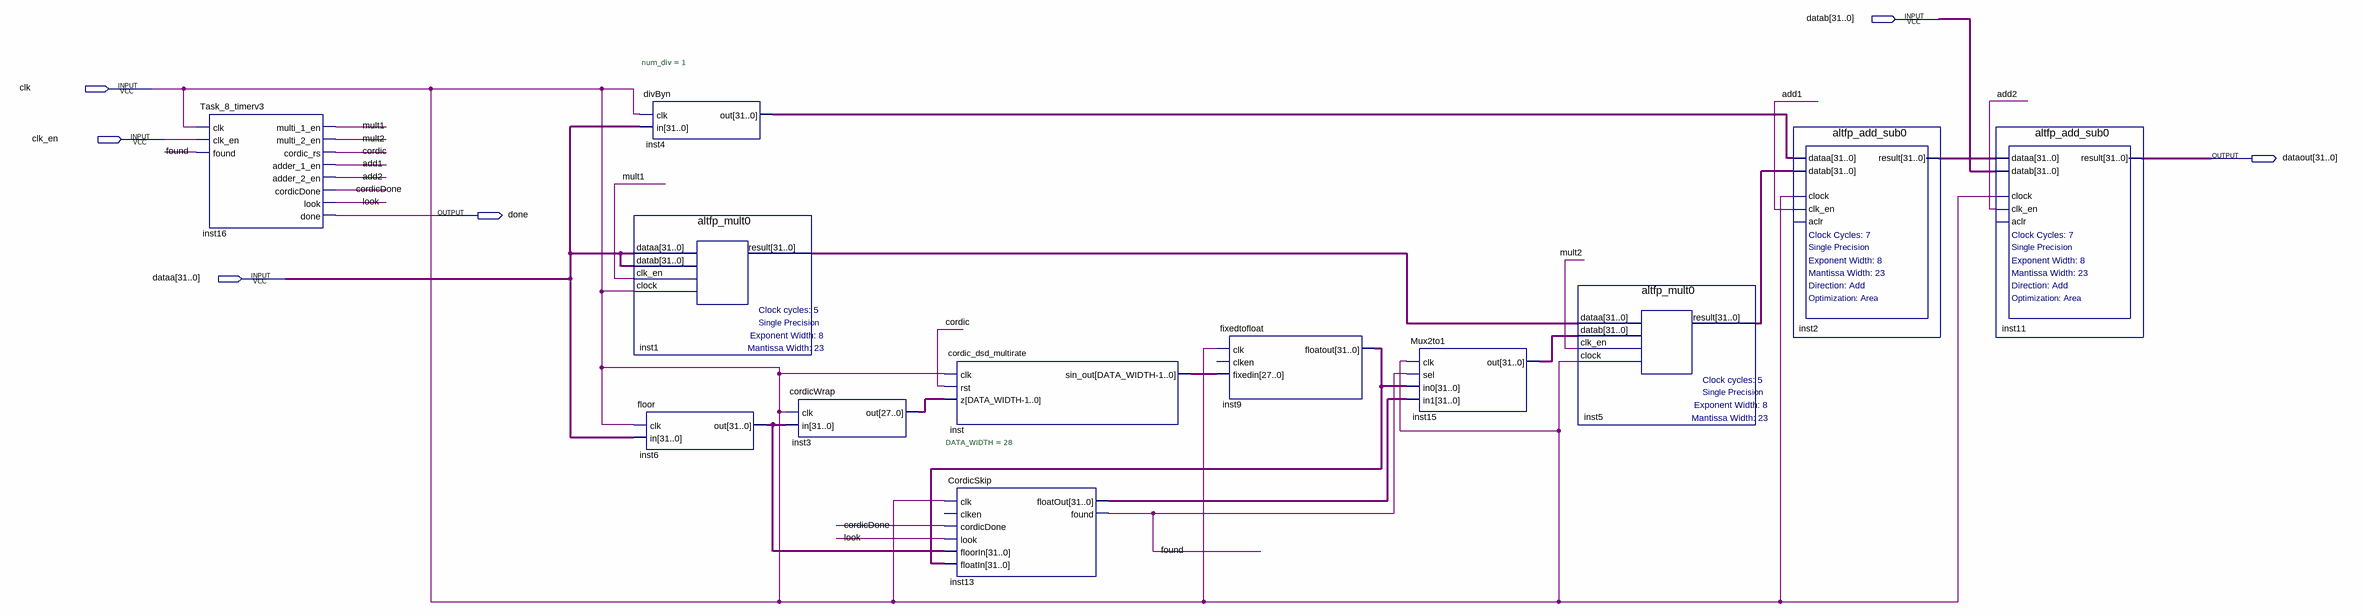
[diagram p0: schematic sheet]
// Quartus schematic task8v3.bdf as structural Verilog: 12 symbols, 6 pins
module task8v3 (
  input  [31:0] datab,
  input  clk,
  input  clk_en,
  input  [31:0] dataa,
  output [31:0] dataout,
  output done
);

  wire add1, add2, cordic, cordicDone, found, look, mult1, mult2;
  wire [27:0] inst3_out, inst_sin_out;
  wire [31:0] inst1_result, inst2_result, inst4_out, inst5_result, inst6_out, inst9_floatout,
       inst13_floatout, inst15_out;

  Task_8_timerv3 inst16 (
    .clk(clk), .clk_en(clk_en), .found(found), .multi_1_en(mult1), .multi_2_en(mult2), .cordic_rs(cordic),
    .adder_1_en(add1), .adder_2_en(add2), .cordicDone(cordicDone), .look(look), .done(done));
  divByn #(.num_div(1)) inst4 (.clk(clk), .in(dataa), .out(inst4_out));
  altfp_mult0 inst1 (.dataa(dataa), .datab(dataa), .clk_en(mult1), .clock(clk), .result(inst1_result));
  floor inst6 (.clk(clk), .in(dataa), .out(inst6_out));
  cordicWrap inst3 (.clk(clk), .in(inst6_out), .out(inst3_out));
  cordic_dsd_multirate #(.DATA_WIDTH(28)) inst (.clk(clk), .rst(cordic), .z(inst3_out), .sin_out(inst_sin_out));
  CordicSkip inst13 (
    .clk(clk), .cordicDone(cordicDone), .look(look), .floorIn(inst6_out), .floatIn(inst9_floatout),
    .floatOut(inst13_floatout), .found(found));  // open: clken
  fixedtofloat inst9 (.clk(clk), .fixedin(inst_sin_out), .floatout(inst9_floatout));  // open: clken
  Mux2to1 inst15 (.clk(clk), .sel(found), .in0(inst9_floatout), .in1(inst13_floatout), .out(inst15_out));
  altfp_mult0 inst5 (.dataa(inst1_result), .datab(inst15_out), .clk_en(mult2), .clock(clk), .result(inst5_result));
  altfp_add_sub0 inst2 (
    .dataa(inst4_out), .datab(inst5_result), .clock(clk), .clk_en(add1), .result(inst2_result));  // open: aclr
  altfp_add_sub0 inst11 (
    .dataa(inst2_result), .datab(datab), .clock(clk), .clk_en(add2), .result(dataout));  // open: aclr
endmodule
